# Altium schematic sheet PCB_Project_Board_3.SchDoc
size A3; SheetNumber: 1; SheetTotal: 1
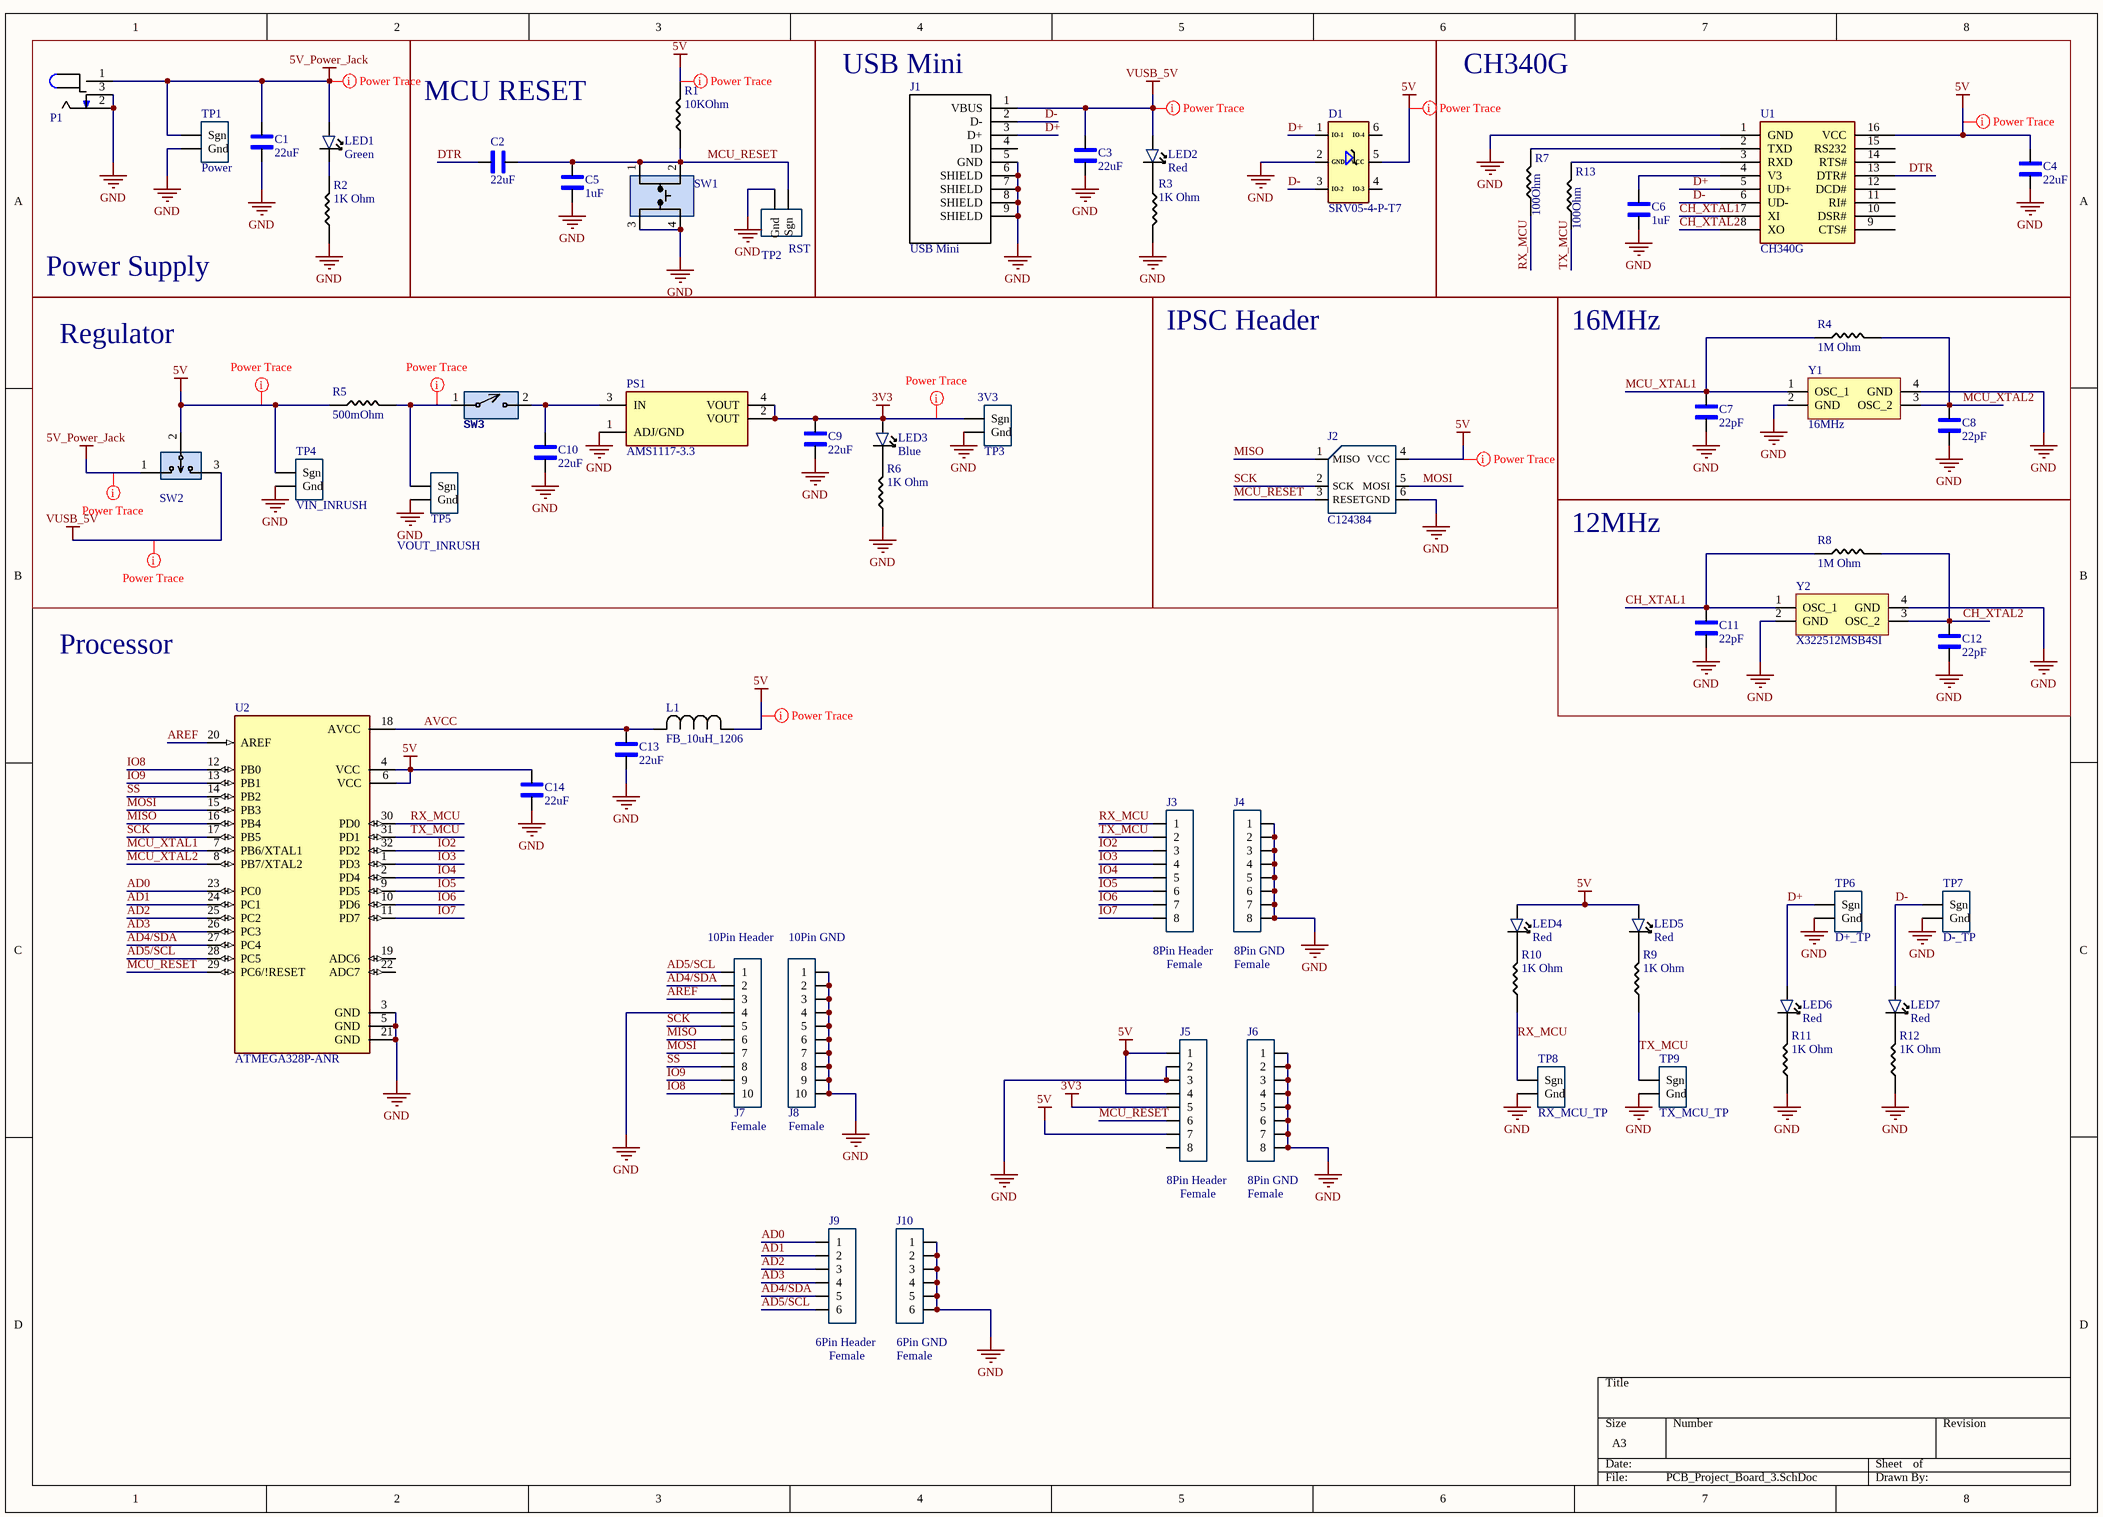
[diagram p0: PCB_Project_Board_3.SchDoc]

## Parts
C1  22uF  [1206_Passive_Capacitor]
C2  22uF  [1206_Passive_Capacitor]
C3  22uF  [1206_Passive_Capacitor]
C4  22uF  [1206_Passive_Capacitor]
C5  1uF  [1206_Passive_Capacitor]
C6  1uF  [1206_Passive_Capacitor]
C7  22pF  [1206_Passive_Capacitor]
C8  22pF  [1206_Passive_Capacitor]
C9  22uF  [1206_Passive_Capacitor]
C10  22uF  [1206_Passive_Capacitor]
C11  22pF  [1206_Passive_Capacitor]
C12  22pF  [1206_Passive_Capacitor]
C13  22uF  [1206_Passive_Capacitor]
C14  22uF  [1206_Passive_Capacitor]
D1  SRV05-4-P-T7  [TVS]
J1  USB Mini  [USB_MINI_B]
J2  LCSC Part#: C124384  [ICSP]  (hidden comment: NRPN032PAEN-RC)
J3  8Pin Header  value Female  [8_PIN_100MIL - Female]
J4  8Pin GND  value Female  [8_PIN_100MIL - Female]
J5  8Pin Header  value Female  [8_PIN_100MIL - Female]
J6  8Pin GND  value Female  [8_PIN_100MIL - Female]
J7  10Pin Header  value Female  [10_PIN_100MIL - Female]
J8  10Pin GND  value Female  [10_PIN_100MIL - Female]
J9  6Pin Header  value Female  [6_PIN_100MIL -Female]
J10  6Pin GND  value Female  [6_PIN_100MIL -Female]
L1  FB_10uH_1206  [AIML-1206_ABR-M]
LED1  Green  [LED_1206]
LED2  Red  [LED_1206]
LED3  Blue  [LED_1206]
LED4  Red  [LED_1206]
LED5  Red  [LED_1206]
LED6  Red  [LED_1206]
LED7  Red  [LED_1206]
P1  Power Jack  [Power_Jack]  (value not drawn)
PS1  AMS1117-3.3  [LDO]
R1  value 10KOhm  [1206_Passive_Resitor]  (hidden comment: 10k)
R2  value 1K Ohm  [1206_Passive_Resitor]  (hidden comment: 1k)
R3  value 1K Ohm  [1206_Passive_Resitor]  (hidden comment: 1k)
R4  value 1M Ohm  [1206_Passive_Resitor]  (hidden comment: 1M)
R5  value 500mOhm  [1206_Passive_Resitor]  (hidden comment: 500m)
R6  value 1K Ohm  [1206_Passive_Resitor]  (hidden comment: 1k)
R7  100Ohm  [1206_Passive_Resitor]
R8  value 1M Ohm  [1206_Passive_Resitor]  (hidden comment: 1M)
R9  value 1K Ohm  [1206_Passive_Resitor]  (hidden comment: 1k)
R10  value 1K Ohm  [1206_Passive_Resitor]  (hidden comment: 1k)
R11  value 1K Ohm  [1206_Passive_Resitor]  (hidden comment: 1k)
R12  value 1K Ohm  [1206_Passive_Resitor]  (hidden comment: 1k)
R13  100Ohm  [1206_Passive_Resitor]
SW1  TL3305AF160QG  [Switch_JLC]  (value not drawn)
SW2  PREC003SAAN-RC  [3_PIN_100mil]  (value not drawn)
SW3  SW_2Pin_100mil_Switch  [2Pin-Header-Conn]  (value not drawn)
TP1  Power  [TP10x_Probe]
TP2  RST  [TP10x_Probe]
TP3  3V3  [TP10x_Probe]
TP4  VIN_INRUSH  [TP10x_Probe]
TP5  VOUT_INRUSH  [TP10x_Probe]
TP6  D+_TP  [TP10x_Probe]
TP7  D-_TP  [TP10x_Probe]
TP8  RX_MCU_TP  [TP10x_Probe]
TP9  TX_MCU_TP  [TP10x_Probe]
U1  CH340G  [USB to serial]
U2  ATMEGA328P-ANR  [ATMega328P]
Y1  value 16MHz  [Crystal resonator]  (hidden comment: X322516MLB4SI)
Y2  X322512MSB4SI  [Crystal resonator]

## Blocks framed on the sheet
Power Supply: C1 LED1 P1 R2 TP1
MCU RESET: C2 C5 R1 SW1 TP2
USB Mini: C3 D1 J1 LED2 R3
CH340G: C4 C6 R7 R13 U1
Regulator: C9 C10 LED3 PS1 R5 R6 SW2 SW3 TP3-TP5
IPSC Header: J2
16MHz: C7 C8 R4 Y1
12MHz: C11 C12 R8 Y2

## Nets
3V3: C9.2 J5.5 LED3.1 PS1.2(VOUT) PS1.4(VOUT) TP3.1(Sgn)
5V: C4.2 C14.2 D1.5(VCC) J2.4(VCC) J5.1 J5.4 J5.7 L1.1 LED4.1 LED5.1 R1.2 R5.1 SW2.2 TP4.1(Sgn) U1.16(VCC) U2.4(VCC) U2.6(VCC)
5V_Power_Jack: C1.2 LED1.1 P1.1 SW2.1 TP1.1(Sgn)
GND: C1.1 C3.1 C4.1 C5.1 C6.1 C7.1 C8.1 C9.1 C10.1 C11.1 C12.1 C13.1 C14.1 D1.2(GND) J1.5(GND) J1.6(SHIELD) J1.7(SHIELD) J1.8(SHIELD) J1.9(SHIELD) J2.6(GND) J4.1 J4.2 J4.3 J4.4 J4.5 J4.6 J4.7 J4.8 J5.2 J5.3 J6.1 J6.2 J6.3 J6.4 J6.5 J6.6 J6.7 J6.8 J7.4 J8.1 J8.2 J8.3 J8.4 J8.5 J8.6 J8.7 J8.8 J8.9 J8.10 J10.1 J10.2 J10.3 J10.4 J10.5 J10.6 P1.2 P1.3 PS1.1(ADJ/GND) R2.1 R3.2 R6.1 R11.1 R12.1 SW1.3 SW1.4 TP1.2(Gnd) TP2.2(Gnd) TP3.2(Gnd) TP4.2(Gnd) TP5.2(Gnd) TP6.2(Gnd) TP7.2(Gnd) TP8.2(Gnd) TP9.2(Gnd) U1.1(GND) U2.3(GND) U2.5(GND) U2.21(GND) Y1.2(GND) Y1.4(GND) Y2.2(GND) Y2.4(GND)
VUSB_5V: C3.2 J1.1(VBUS) LED2.1 SW2.3
AD0: J9.1 U2.23(PC0)
AD1: J9.2 U2.24(PC1)
AD2: J9.3 U2.25(PC2)
AD3: J9.4 U2.26(PC3)
AD4/SDA: J7.2 J9.5 U2.27(PC4)
AD5/SCL: J7.1 J9.6 U2.28(PC5)
AREF: J7.3 U2.20(AREF)
AVCC: C13.2 L1.2 U2.18(AVCC)
CH_XTAL1: C11.2 R8.1 U1.7(XI) Y2.1(OSC_1)
CH_XTAL2: C12.2 R8.2 U1.8(XO) Y2.3(OSC_2)
D+: D1.1(IO-1) J1.3(D+) LED6.1 TP6.1(Sgn) U1.5(UD+)
D-: D1.3(IO-2) J1.2(D-) LED7.1 TP7.1(Sgn) U1.6(UD-)
DTR: C2.1 U1.13(DTR#)
IO2: J3.3 U2.32(PD2)
IO3: J3.4 U2.1(PD3)
IO4: J3.5 U2.2(PD4)
IO5: J3.6 U2.9(PD5)
IO6: J3.7 U2.10(PD6)
IO7: J3.8 U2.11(PD7)
IO8: J7.10 U2.12(PB0)
IO9: J7.9 U2.13(PB1)
MCU_RESET: C2.2 C5.2 J2.3(RESET) J5.6 R1.1 SW1.1 SW1.2 TP2.1(Sgn) U2.29(PC6/!RESET)
MCU_XTAL1: C7.2 R4.1 U2.7(PB6/XTAL1) Y1.1(OSC_1)
MCU_XTAL2: C8.2 R4.2 U2.8(PB7/XTAL2) Y1.3(OSC_2)
MISO: J2.1(MISO) J7.6 U2.16(PB4)
MOSI: J2.5(MOSI) J7.7 U2.15(PB3)
RX_MCU: J3.1 R7.1 R10.1 TP8.1(Sgn) U2.30(PD0)
SCK: J2.2(SCK) J7.5 U2.17(PB5)
SS: J7.8 U2.14(PB2)
TX_MCU: J3.2 R9.1 R13.1 TP9.1(Sgn) U2.31(PD1)
NetC6_2: C6.2 U1.4(V3)
NetC10_2: C10.2 PS1.3(IN) SW3.2
NetLED1_2: LED1.2 R2.2
NetLED2_2: LED2.2 R3.1
NetLED3_2: LED3.2 R6.2
NetLED4_2: LED4.2 R10.2
NetLED5_2: LED5.2 R9.2
NetLED6_2: LED6.2 R11.2
NetLED7_2: LED7.2 R12.2
NetR5_2: R5.2 SW3.1 TP5.1(Sgn)
NetR7_2: R7.2 U1.2(TXD)
NetR13_2: R13.2 U1.3(RXD)

Not connected (* = marked no-connect by the designer): D1 4(IO-3) 6(IO-4); J1 4(ID); J5 8; U1 9(CTS#) 10(DSR#) 11(RI#) 12(DCD#) 14(RTS#) 15(RS232); U2 19(ADC6) 22(ADC7)

## Layout directives
rule Width Constraint [Pref Width = 20mil    Min Width = 10mil    Max Width = 100mil]: 3V3, 5V, 5V_Power_Jack, NetR5_2, VUSB_5V

## Notes on the sheet
- Processor

## Library data of the parts
C1-C4 C9 C10 C13 C14 = C_22uF_1206: 22uF ±10% 25V X5R 1206 Multilayer Ceramic Capacitors MLCC - SMD/SMT RoHS; MFR Part #: CL31A226KAHNNNE; Type: basic; LCSC Part#: C12891; Datasheet: https://datasheet.lcsc.com/lcsc/1811031514_Samsung-Electro-Mechanics-CL31A226KAHNNNE_C12891.pdf; Value: 22uF
C5 C6 = C_1uF_1206: MULTILAYER CERAMIC CAPACITORS MLCC - SMD/SMT 1UF 50V 1206 ROHS; MFR Part #: CL31B105KBHNNNE; Type: Basic; Digikey Link: https://www.digikey.com/product-detail/en/C1206C105M4RACTU/399-8150-1-ND/3471873/?itemSeq=304982366; LCSC Part#: C1848; Value: 1uF
C7 C8 C11 C12 = C_22pF_1206: 22pF ±5% 1kV C0G 1206 Multilayer Ceramic Capacitors MLCC - SMD/SMT RoHS; MFR Part #: 1206CG220J102NT; Type: Extended; LCSC Part#: C313096; Datasheet: https://datasheet.lcsc.com/lcsc/1810311150_FH-Guangdong-Fenghua-Advanced-Tech-1206CG220J102NT_C313096.pdf; Value: 22pF
D1 = D_TVS_Diode: TVS SOT-23-6 ROHS; Value: TVS DIODE 5.5V 6TSOP; Type: Basic; MFR Part #: SRV05-4-P-T7; LCSC Part#: C85364; Datasheet: https://datasheet.lcsc.com/szlcsc/ProTek-Devices-SRV05-4-P-T7_C85364.pdf
J1 = J_USB_B_Mini: Through Hole USB Connectors RoHS; MFR Part #: 920-462A2021D10102; Value: USB mini B; LCSC Part#: C46398; Datasheet: https://datasheet.lcsc.com/szlcsc/2103081233_Jing-Extension-of-the-Electronic-Co-920-462A2021D10102_C46398.pdf; Type: Extended
J2 = J_ICSP: Connector Header Through Hole 6 position 0.079" (2.00mm); Digikey Link: https://www.digikey.com/product-detail/en/NRPN032PAEN-RC/S5801-03-ND/804955/?itemSeq=304982355; MFR Part #: NRPN032PAEN-RC; Type: Extended
J3-J6 = JF_8_PIN_FEMALE: 8 Position Header Connector 0.100" (2.54mm) Through Hole Tin; MFR Part #: PPTC081LFBN-RC; Digikey Link: https://www.digikey.com/product-detail/en/PPTC081LFBN-RC/S7006-ND/810147/?itemSeq=304982354; Type: Extended; LCSC Part#: C27438
J7 J8 = JF_10_PIN_FEMALE_: 10 Position Header Connector 0.100" (2.54mm) Through Hole Tin; MFR Part #: PPTC101LFBN-RC; Digikey Link: https://www.digikey.com/product-detail/en/PPTC101LFBN-RC/S7008-ND/810149/?itemSeq=304982352; LCSC Part#: C225507; Type: Extended
J9 J10 = JF_6_PIN_FEMALE: 6 Position Header Connector 0.100" (2.54mm) Through Hole Tin; MFR Part #: PPTC061LFBN-RC; Digikey Link: https://www.digikey.com/product-detail/en/PPTC061LFBN-RC/S7004-ND/810145/?itemSeq=304982353; LCSC Part#: C40877; Type: Extended
L1 = FB_10uH_1206: 25mA 10uH ±10% 800mΩ 1206  Inductors (SMD) ROHS; Mfr_Name: FH (Guangdong Fenghua Advanced Tech); MFR PART #: CMI321609X100KT; Type: Basic; LCSC PART#: C1051; DataSheet: https://datasheet.lcsc.com/lcsc/1810311314_FH--Guangdong-Fenghua-Advanced-Tech-CMI321609X100KT_C1051.pdf
LED1 = LED_GREEN_1206: Green 513~528nm 1206 Light Emitting Diodes (LED) RoHS; MFR Part #: SZYY1206G; Type: Extended; LCSC Part#: C434439; Datasheet: https://datasheet.lcsc.com/lcsc/2006301532_Yongyu-Photoelectric-SZYY1206G_C434439.pdf; Value: Green
LED2 LED4-LED7 = LED_RED_1206: Red 621~631nm 1206 Light Emitting Diodes (LED) RoHS; MFR Part #: 15-21/R6C-FQ1R1B/2T; Type: Extended; LCSC Part#: C93133; Datasheet: https://datasheet.lcsc.com/szlcsc/1811151241_Everlight-Elec-15-21-R6C-FQ1R1B-2T_C93133.pdf; Value: Red
LED3 = LED_BLUE_1206: blue 1206  Light Emitting Diodes (LED) ROHS; MFR Part #: NCD1206B1; Type: Extended; LCSC Part#: C130717; Datasheet: https://datasheet.lcsc.com/lcsc/2008201033_Foshan-NationStar-Optoelectronics-NCD1206B1_C130717.pdf; Value: Blue
P1 = P_Power Jack: Power Barrel Connector Jack 2.10mm ID (0.083"), 5.50mm OD (0.217") Through Hole, Right Angle; MFR Part #: PJ-102A; Value: CONN PWR JACK 2X5.5MM SOLDER; Digikey Link: https://www.digikey.com/product-detail/en/PJ-102A/CP-102A-ND/275425/?itemSeq=304982367; LCSC Part#: C136744; Type: Extended
PS1 = PS_AMS_LDO_3v3: LOW DROPOUT REGULATORS(LDO) POSITIVE FIXED 1.3V @ 800MA 15V 3.3V 1A SOT-223 ROHS; Value: IC REG LINEAR 3.3V 800MA SOT223; MFR Part #: AMS1117-3.3; LCSC Part#: C6186; Type: Basic
R1 = R_10KOhm_1206: 10 kOhms ±5% 0.25W, 1/4W Chip Resistor 1206 (3216 Metric) Automotive AEC-Q200 Thick Film; MFR Part #: RMCF1206FT10K0; Digikey Link: https://www.digikey.com/en/products/detail/stackpole-electronics-inc/RMCF1206FT10K0/1759669; LCSC Part#: C17902; Type: Basic
R2 R3 R6 R9-R12 = R_1K_1206: CHIP RESISTOR - SURFACE MOUNT 1KOHMS ±1% 1/4W 1206 ROHS; MFR Part #: RNCP1206FTD1K00CT; Digikey Link: https://www.digikey.com/product-detail/en/RNCP1206FTD1K00/RNCP1206FTD1K00CT-ND/2240675/?itemSeq=304982373; LCSC Part#: C4410; Type: Basic
R4 R8 = R_1M_1206: CHIP RESISTOR - SURFACE MOUNT 1MOHMS ±1% 1/4W 1206 ROHS; MFR Part #: RMCF1206JT1M00; Digikey Link: https://www.digikey.com/product-detail/en/RMCF1206JT1M00/RMCF1206JT1M00CT-ND/1942830/?itemSeq=304982358; LCSC Part#: C17927; Type: Basic
R5 = R_500mOhm_1206: Resistors/Shunt 250mW 500mΩ ±800ppm/℃ ±5% 1206  Current Sense  Resistors ROHS; MFR Part #: 1206W4J050KT5E; Datasheet: https://datasheet.lcsc.com/lcsc/1810301438_UNI-ROYAL-Uniroyal-Elec-1206W4J050KT5E_C247433.pdf; LCSC Part#: C247433; Type: Extended
R7 R13 = R_100Ohm_1206: 100Ω ±1% 0.25W ±100ppm/℃ 1206 Chip Resistor - Surface Mount RoHS; MFR Part #: 1206W4F1000T5E; LCSC Part#: C17901; Datasheet: https://datasheet.lcsc.com/lcsc/2206010145_UNI-ROYAL-Uniroyal-Elec-1206W4F1000T5E_C17901.pdf; Type: Basic; Value: 100Ohm
SW1 = SW_Push_Button_JLC: Tactile Switch SPST-NO Top Actuated Surface Mount; MFR Part #: KH-4.5X4.5X4.3H-STM; LCSC Part#: C2837550; Type: Extended; DataSheet: https://datasheet.lcsc.com/lcsc/2106081532_Shenzhen-Kinghelm-Elec-KH-4.5X4.5X4.3H-STM_C2837550.pdf
SW2 = SW_3Pin_100mil_Switch: Connector Header Through Hole 3 position 0.100" (2.54mm); Value: CONN HEADER VERT 3POS 2.54MM; Digikey Link: https://www.digikey.com/product-detail/en/PREC003SAAN-RC/S1012EC-03-ND/2774851/?itemSeq=304982371; MFR Part #: PREC003SAAN-RC; Type: Extended; LCSC Part#: C49257
SW3 = SW_2Pin_100mil_Switch: 2Pin Header; LCSC Part#: C124375; Type: Extended
TP1-TP9 = TP_10x_Probe: Test Point 300 mil centers
U1 = U_USBtoSerial: Transceiver USB 2.0 2Mbps SOP-16_150mil USB ICs RoHS; Datasheet: https://datasheet.lcsc.com/lcsc/2008191806_WCH-Jiangsu-Qin-Heng-CH340G_C14267.pdf; LCSC Part#: C14267; MFR Part #: CH340G; Type: Basic; Value: USB to Serial
U2 = U_ATMega328P: AVR AVR® ATmega Microcontroller IC 8-Bit 20MHz 32KB (16K x 16) FLASH 32-TQFP (7x7); MFR Part #: ATMEGA328P-AU; Value: IC MCU 8BIT 32KB FLASH 32TQFP; Digikey Link: https://www.digikey.com/product-detail/en/ATMEGA328P-ANR/ATMEGA328P-ANRCT-ND/2774230/?itemSeq=304982365; LCSC Part#: C14877; Type: Basic
Y1 = X_16Mhz_Res: ±10ppm 16000000Hz -40℃~85℃ 贴片无源晶振 60Ω 9pF SMD3225-4P Crystals ROHS; LCSC Part#: C13738; MFR Part #: X322516MLB4SI; Type: Basic
Y2 = X_12MHz_Res: SMD Crystal Resonators 12MHz ±10ppm SMD-3225_4P RoHS; LCSC Part#: C9002; MFR Part #: X322512MSB4SI; Value: 12MHz; Type: Basic; Datasheet: https://datasheet.lcsc.com/szlcsc/Yangxing-Tech-X322512MSB4SI_C9002.pdf